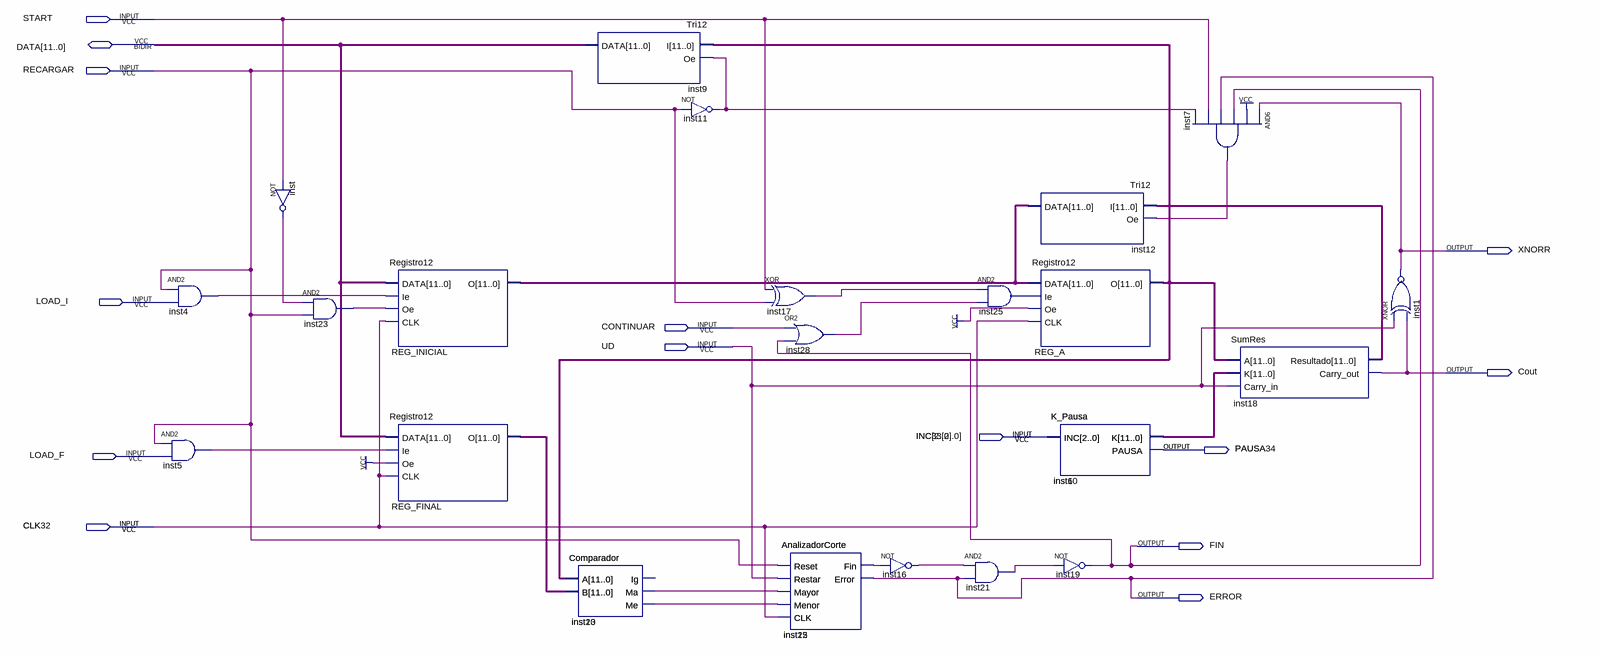
[diagram p0: schematic sheet]
// Quartus schematic PruebaPrincipal.bdf as structural Verilog: 25 symbols, 17 pins
module PruebaPrincipal (
  input  START,
  input  RECARGAR,
  input  LOAD_I,
  input  CONTINUAR,
  input  UD,
  input  [2:0] INC,
  input  [2:0] INC33,
  input  LOAD_F,
  input  CLK,
  input  CLK32,
  inout  [11:0] DATA,
  output XNORR,
  output Cout,
  output PAUSA,
  output PAUSA34,
  output FIN,
  output ERROR
);

  wire inst4_out, inst5_out, inst7_out, inst11_out, inst13_ig, inst13_ma, inst13_me, inst15_fin, inst16_out,
       inst17_out, inst21_out, inst23_out, inst25_out, inst28_out, inst_out;
  wire [11:0] inst6_k, inst18_resultado, REG_A_o, REG_FINAL_o, REG_INICIAL_o;

  and inst4 (inst4_out, RECARGAR, LOAD_I);
  and inst5 (inst5_out, RECARGAR, LOAD_F);
  not inst (inst_out, START);
  and inst23 (inst23_out, inst_out, RECARGAR);
  Registro12 REG_INICIAL (.DATA(DATA), .Ie(inst4_out), .Oe(inst23_out), .CLK(CLK), .O(REG_INICIAL_o));
  Registro12 REG_FINAL (.DATA(DATA), .Ie(inst5_out), .Oe(1'b1), .CLK(CLK), .O(REG_FINAL_o));
  Comparador inst13 (.A(REG_A_o), .B(REG_FINAL_o), .Ig(inst13_ig), .Ma(inst13_ma), .Me(inst13_me));
  Comparador inst20 (.A(REG_A_o), .B(REG_FINAL_o), .Ig(inst13_ig), .Ma(inst13_ma), .Me(inst13_me));
  Tri12 inst9 (.I(REG_A_o), .Oe(inst11_out), .DATA(DATA));
  not inst11 (inst11_out, RECARGAR);
  xor inst17 (inst17_out, START, RECARGAR);
  or inst28 (inst28_out, CONTINUAR, FIN);
  AnalizadorCorte inst15 (
    .Reset(RECARGAR), .Restar(UD), .Mayor(inst13_ma), .Menor(inst13_me), .CLK(CLK), .Fin(inst15_fin),
    .Error(ERROR));
  AnalizadorCorte inst22 (
    .Reset(RECARGAR), .Restar(UD), .Mayor(inst13_ma), .Menor(inst13_me), .CLK(CLK), .Fin(inst15_fin),
    .Error(ERROR));
  not inst16 (inst16_out, inst15_fin);
  and inst25 (inst25_out, inst17_out, inst28_out);
  and inst21 (inst21_out, inst16_out, ERROR);
  Tri12 inst12 (.I(inst18_resultado), .Oe(inst7_out), .DATA(REG_INICIAL_o));
  Registro12 REG_A (.DATA(REG_INICIAL_o), .Ie(inst25_out), .Oe(1'b1), .CLK(CLK), .O(REG_A_o));
  K_Pausa inst6 (.INC(INC), .K(inst6_k), .PAUSA(PAUSA));
  K_Pausa inst10 (.INC(INC), .K(inst6_k), .PAUSA(PAUSA));
  not inst19 (FIN, inst21_out);
  and inst7 (inst7_out, XNORR, 1'b1, FIN, ERROR, START, inst11_out);
  SumRes inst18 (.A(REG_A_o), .K(inst6_k), .Carry_in(UD), .Resultado(inst18_resultado), .Carry_out(Cout));
  xnor inst1 (XNORR, UD, Cout);

  assign CLK32 = CLK;
  assign INC33 = INC;
  assign PAUSA34 = PAUSA;
endmodule
